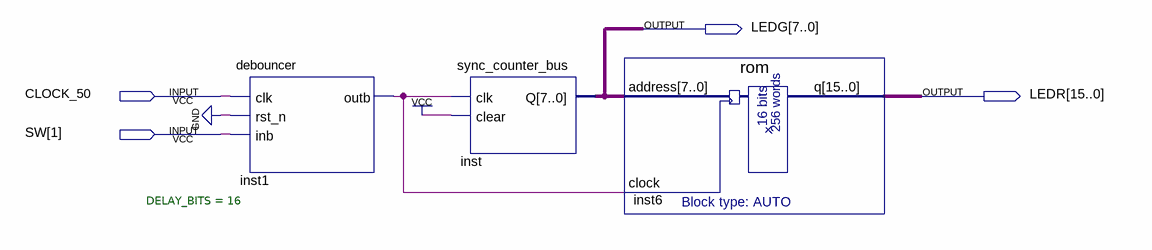
[diagram p0: schematic sheet]
// Quartus schematic test_rom.bdf as structural Verilog: 3 symbols, 4 pins
module test_rom (
  input  CLOCK_50,
  input  [1:1] SW,
  output [7:0] LEDG,
  output [15:0] LEDR
);

  wire inst1_outb;

  debouncer #(.DELAY_BITS(16)) inst1 (.clk(CLOCK_50), .rst_n(1'b0), .inb(SW[1]), .outb(inst1_outb));
  sync_counter_bus inst (.clk(inst1_outb), .clear(1'b1), .Q(LEDG));
  rom inst6 (.address(LEDG), .clock(inst1_outb), .q(LEDR));
endmodule
